# EAGLE schematic CURIO1 (EAGLE 7.2.0)
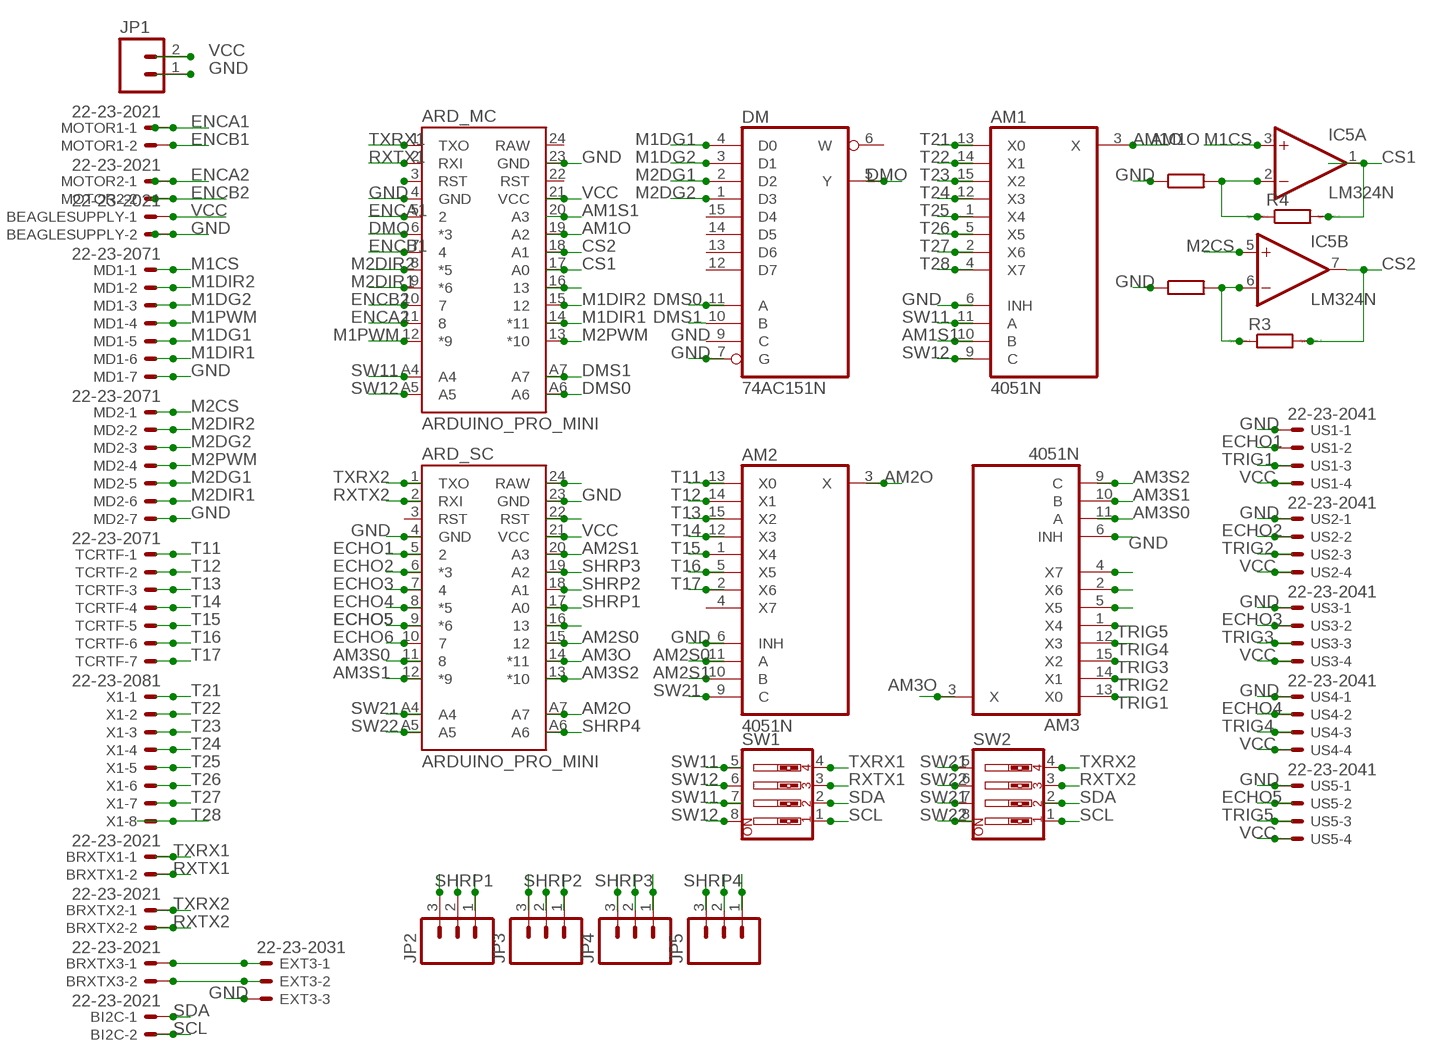
[diagram p0: schematic, sheet 1]

## Parts
AM1  4051N  [DIL16]
AM2  4051N  [DIL16]
AM3  4051N  [DIL16]
ARD_MC  ARDUINO_PRO_MINI  [ARDUINO_PRO_MINI]
ARD_SC  ARDUINO_PRO_MINI  [ARDUINO_PRO_MINI]
BEAGLESUPPLY  22-23-2021  [22-23-2021]
BI2C  22-23-2021  [22-23-2021]
BRXTX1  22-23-2021  [22-23-2021]
BRXTX2  22-23-2021  [22-23-2021]
BRXTX3  22-23-2021  [22-23-2021]
DM  74AC151N  [DIL16]
EXT3  22-23-2031  [22-23-2031]
IC5  LM324N  [DIL14]
JP1  M025MM  [SCREWTERMINAL-5MM-2]
JP2  M03JST-PTH-VERT  [JST-3-PTH-VERT]
JP3  M03JST-PTH-VERT  [JST-3-PTH-VERT]
JP4  M03JST-PTH-VERT  [JST-3-PTH-VERT]
JP5  M03JST-PTH-VERT  [JST-3-PTH-VERT]
MD1  22-23-2071  [22-23-2071]
MD2  22-23-2071  [22-23-2071]
MOTOR1  22-23-2021  [22-23-2021]
MOTOR2  22-23-2021  [22-23-2021]
R3  R0204/7  [0204/7]
R4  R0204/7  [0204/7]
SW1  SW_DIP-4  [EDG-04]
SW2  SW_DIP-4  [EDG-04]
TCRTF  22-23-2071  [22-23-2071]
US1  22-23-2041  [22-23-2041]
US2  22-23-2041  [22-23-2041]
US3  22-23-2041  [22-23-2041]
US4  22-23-2041  [22-23-2041]
US5  22-23-2041  [22-23-2041]
X1  22-23-2081  [22-23-2081]

## Nets
AM1O: AM1.3(X) ARD_MC.19(A2)
AM1S1: AM1.10(B) ARD_MC.20(A3)
AM2O: AM2.3(X) ARD_SC.A7
AM2S0: AM2.11(A) ARD_SC.15
AM2S1: AM2.10(B) ARD_SC.20(A3)
AM3O: AM3.3(X) ARD_SC.14(*11)
AM3S0: AM3.11(A) ARD_SC.11
AM3S1: AM3.10(B) ARD_SC.12(*9)
AM3S2: AM3.9(C) ARD_SC.13(*10)
CS1: ARD_MC.17(A0) IC5.1(A:OUT) R4.2
CS2: ARD_MC.18(A1) IC5.7(B:OUT) R3.2
DMO: ARD_MC.6(*3) DM.5(Y)
DMS0: ARD_MC.A6 DM.11(A)
DMS1: ARD_MC.A7 DM.10(B)
ECHO1: ARD_SC.5 US1.2
ECHO2: ARD_SC.6(*3) US2.2
ECHO3: ARD_SC.7 US3.2
ECHO4: ARD_SC.8(*5) US4.2
ECHO5: ARD_SC.9(*6) US5.2
ECHO6: ARD_SC.10
ENCA1: ARD_MC.5 MOTOR1.1
ENCA2: ARD_MC.11 MOTOR2.1
ENCB1: ARD_MC.7
ENCB2: ARD_MC.10 MOTOR2.2
GND: AM1.6(INH) AM2.6(INH) AM3.6(INH) ARD_MC.4(GND) ARD_MC.23(GND) ARD_SC.4(GND) ARD_SC.23(GND) BEAGLESUPPLY.2 DM.7(G) EXT3.3 JP1.1 JP2.2 JP3.2 JP4.2 JP5.2 MD1.7 MD2.7 US1.1 US2.1 US3.1 US4.1 US5.1
M1CS: IC5.3(A:+IN) MD1.1
M1DG1: DM.4(D0) MD1.5
M1DG2: DM.3(D1) MD1.3
M1DIR1: ARD_MC.14(*11) MD1.6
M1DIR2: ARD_MC.15 MD1.2
M1PWM: ARD_MC.12(*9) MD1.4
M2CS: IC5.5(B:+IN) MD2.1
M2DG1: DM.2(D2) MD2.5
M2DG2: DM.1(D3) MD2.3
M2DIR1: ARD_MC.9(*6) MD2.6
M2DIR2: ARD_MC.8(*5) MD2.2
M2PWM: ARD_MC.13(*10) MD2.4
N$1: BRXTX3.1 EXT3.1
N$2: BRXTX3.2 EXT3.2
N$3: IC5.2(A:-IN) R4.1
N$4: AM3.4(X7)
N$5: AM3.2(X6)
N$6: AM3.5(X5)
N$7: IC5.6(B:-IN) R3.1
N$14: ARD_MC.3(RST)
N$21: ARD_MC.16
N$24: ARD_SC.16
N$29: ARD_SC.22(RST)
N$31: ARD_SC.24(RAW)
RXTX1: ARD_MC.2(RXI) BRXTX1.2 SW1.3
RXTX2: ARD_SC.2(RXI) BRXTX2.2 SW2.3
SCL: BI2C.2 SW1.1 SW2.1
SDA: BI2C.1 SW1.2 SW2.2
SHRP1: ARD_SC.17(A0) JP2.1
SHRP2: ARD_SC.18(A1) JP3.1
SHRP3: ARD_SC.19(A2) JP4.1
SHRP4: ARD_SC.A6 JP5.1
SW11: AM1.11(A) ARD_MC.A4 SW1.5 SW1.7
SW12: AM1.9(C) ARD_MC.A5 SW1.6 SW1.8
SW21: AM2.9(C) ARD_SC.A4 SW2.5 SW2.7
SW22: ARD_SC.A5 SW2.6 SW2.8
T11: AM2.13(X0) TCRTF.1
T12: AM2.14(X1) TCRTF.2
T13: AM2.15(X2) TCRTF.3
T14: AM2.12(X3) TCRTF.4
T15: AM2.1(X4) TCRTF.5
T16: AM2.5(X5) TCRTF.6
T17: AM2.2(X6) TCRTF.7
T21: AM1.13(X0) X1.1
T22: AM1.14(X1) X1.2
T23: AM1.15(X2) X1.3
T24: AM1.12(X3) X1.4
T25: AM1.1(X4) X1.5
T26: AM1.5(X5) X1.6
T27: AM1.2(X6) X1.7
T28: AM1.4(X7) X1.8
TRIG1: AM3.13(X0) US1.3
TRIG2: AM3.14(X1) US2.3
TRIG3: AM3.15(X2) US3.3
TRIG4: AM3.12(X3) US4.3
TRIG5: AM3.1(X4) US5.3
TXRX1: ARD_MC.1(TXO) BRXTX1.1 SW1.4
TXRX2: ARD_SC.1(TXO) BRXTX2.1 SW2.4
VCC: ARD_MC.21(VCC) ARD_SC.21(VCC) JP1.2 JP2.3 JP3.3 JP4.3 JP5.3 US1.4 US2.4 US3.4 US4.4 US5.4
Unconnected: AM2.4(X7) ARD_MC.22(RST) ARD_MC.24(RAW) ARD_SC.3(RST) BEAGLESUPPLY.1 DM.6(W) DM.9(C) DM.12(D7) DM.13(D6) DM.14(D5) DM.15(D4) IC5.8(C:OUT) IC5.9(C:-IN) IC5.10(C:+IN) IC5.12(D:+IN) IC5.13(D:-IN) IC5.14(D:OUT) MOTOR1.2

## Power pins joined to a net without a drawn wire
GND: AM1.8(GND) AM2.8(GND) AM3.8(GND) DM.8(GND)
V+: IC5.4(P:V+)
V-: IC5.11(P:V-)
VCC: AM1.16(VCC) AM2.16(VCC) AM3.16(VCC) DM.16(VCC)
VEE: AM1.7(VEE) AM2.7(VEE) AM3.7(VEE)

## Library data of the parts
AM1-AM3 = 40xx:4051: 8-channel ANALOG MULTIPLEXER
ARD_MC ARD_SC = SparkFun-Boards:ARDUINO_PRO_MINI
BEAGLESUPPLY BI2C BRXTX1-BRXTX3 MOTOR1 MOTOR2 = con-molex:22-23-2021: .100" (2.54mm) Center Header - 2 Pin; MF: MOLEX; MPN: 22-23-2021; OC_FARNELL: 1462926; OC_NEWARK: 25C3832
DM = 74xx-eu:74*151: Data SELECTOR/MULTIPLEXER
EXT3 = con-molex:22-23-2031: .100" (2.54mm) Center Header - 3 Pin; MF: MOLEX; MPN: 22-23-2031; OC_FARNELL: 1462950; OC_NEWARK: 30C0862
IC5 = linear:LM324: OP AMP
JP1 = SparkFun-Connectors:M02: Standard 2-pin 0.1" header. Use with - straight break away headers ( PRT-00116) - right angle break away headers (PRT-00553) - swiss pins (PRT-00743) - machine pins (PRT-00117) - female headers (PRT-00115) Molex polarized connector foot print use with: PRT-08233 with associated crimp pins and housings. 2.54_SCREWTERM for use with PRT-10571. 3.5mm Screw Terminal footprints for PRT-08084 5mm Screw Terminal footprints for use with PRT-08432; STOREFRONT_ID: PRT-08432
JP2-JP5 = SparkFun-Connectors:M03: Header 3 Standard 3-pin 0.1" header. Use with straight break away headers (SKU : PRT-00116), right angle break away headers (PRT-00553), swiss pins (PRT-00743), machine pins (PRT-00117), and female headers (PRT-00115). Molex polarized connector foot print use with SKU : PRT-08232 with associated crimp pins and housings.
MD1 MD2 TCRTF = con-molex:22-23-2071: .100" (2.54mm) Center Header - 7 Pin; MF: MOLEX; MPN: 22-23-2071; OC_FARNELL: 1654534; OC_NEWARK: 56H0445
R3 R4 = eagle-ltspice:R: RESISTOR, European symbol; SPICEMODEL: NONE; SPICEPREFIX: R
SW1 SW2 = special:SW_DIP-4: DIP SWITCH
US1-US5 = con-molex:22-23-2041: .100" (2.54mm) Center Header - 4 Pin; MF: MOLEX; MPN: 22-23-2041; OC_FARNELL: 1462920; OC_NEWARK: 38C0355
X1 = con-molex:22-23-2081: .100" (2.54mm) Center Header - 8 Pin; MF: MOLEX; MPN: 22-23-2081; OC_FARNELL: 1756826; OC_NEWARK: 01C7592